# Altium project PCB_Project.PrjPcb
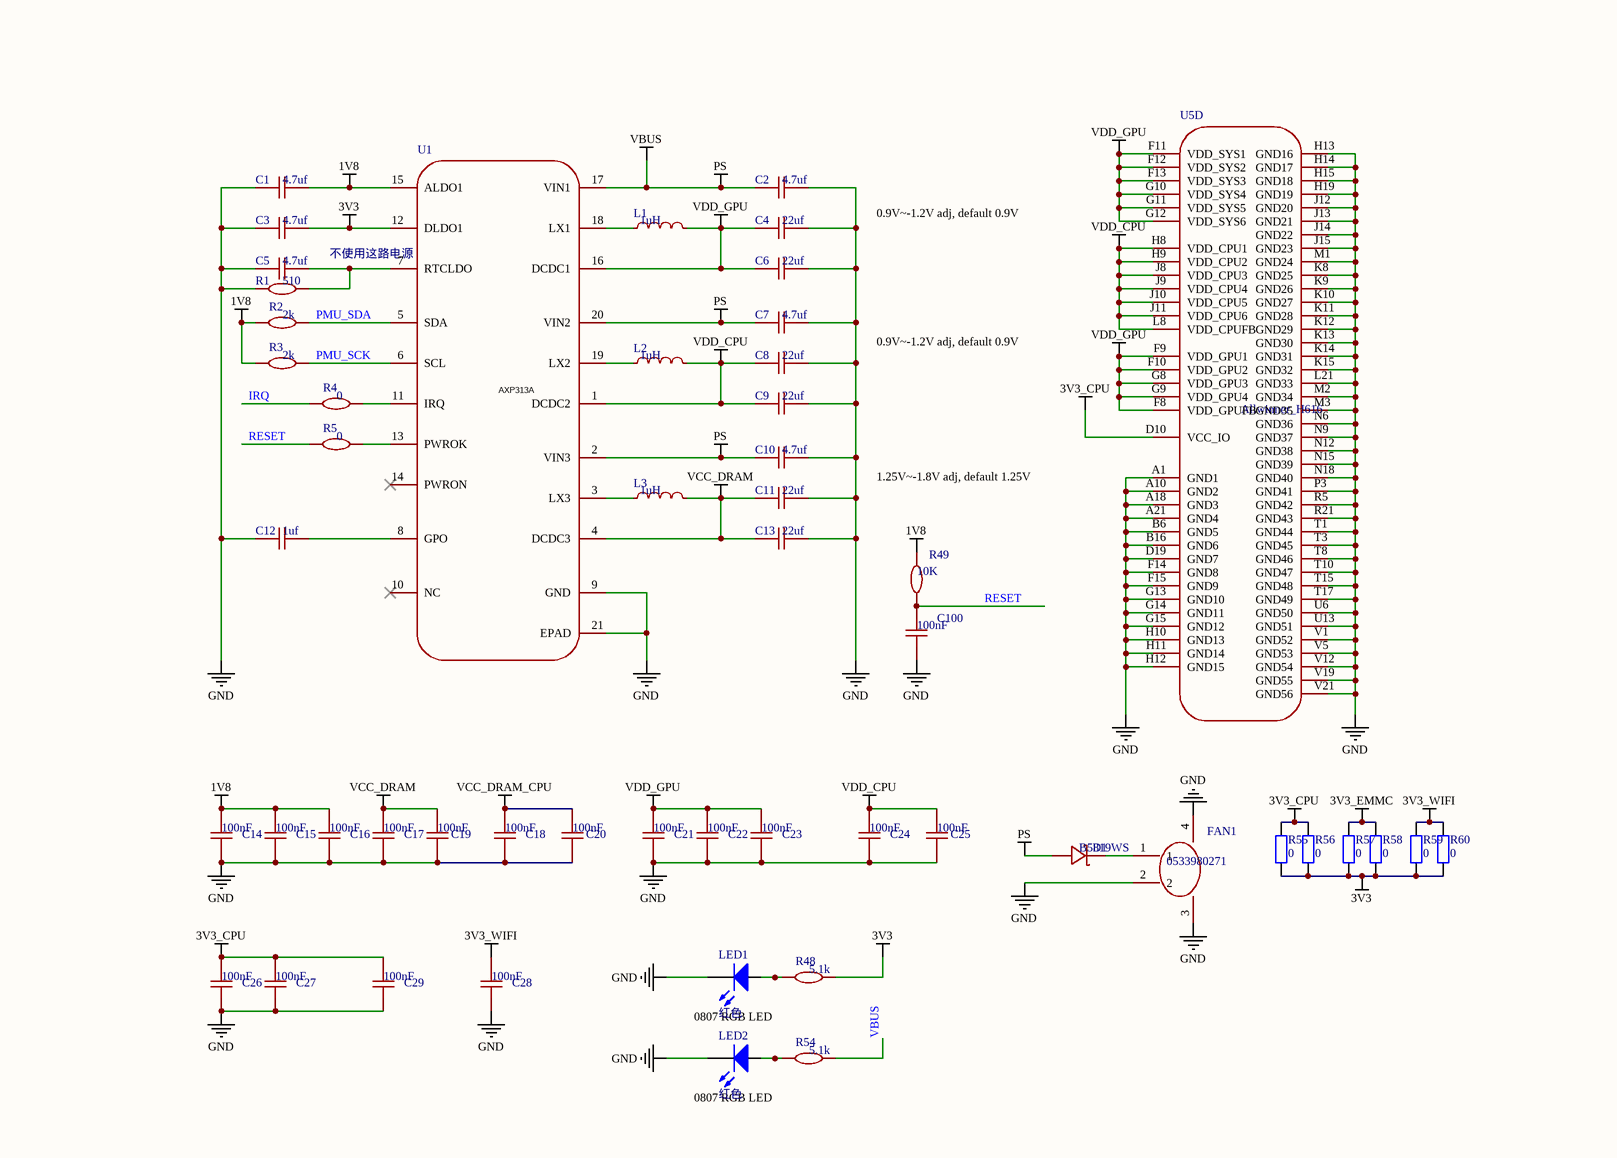
[diagram p0: 1_POWER.schdoc]
4 sheets, 155 parts. Net scope: global (net labels, ports and power ports of the same name join across sheets).
Board file: PCB.pcbdoc
Sheets:
  1_POWER.schdoc
  2_DRAM.schdoc
  3_IO.schdoc
  4_PREP.schdoc

## Sheet 1_POWER.schdoc
size 302 x 215 mm; Symbol: Sheet_A4; Device: Sheet_A4; @Project Name: Yuzuki Chameleon 基于H616的卡片电脑; REV: 1.0; Date: 2021-09-08; Sheet: 1/1; Draw By: GloomyGhost; Company: YuzukiHD; Version: 1.0; @Page No: 1; @Page Count: 4; @Update Date: 2025-03-02; SheetNumber: 1; SheetTotal: 4

### Parts
C1  4.7uf  [C0402]
C2  4.7uf  [C0603]
C3  4.7uf  [C0402]
C4  22uf  [C0603]
C5  4.7uf  [C0402]
C6  22uf  [C0603]
C7  4.7uf  [C0603]
C8  22uf  [C0603]
C9  22uf  [C0603]
C10  4.7uf  [C0603]
C11  22uf  [C0603]
C12  1uf  [C0402]
C13  22uf  [C0603]
C14  100nF  [C0402-NSK]
C15  100nF  [C0402-NSK]
C16  100nF  [C0402-NSK]
C17  100nF  [C0402-NSK]
C18  100nF  [C0402-NSK]
C19  100nF  [C0402-NSK]
C20  100nF  [C0402-NSK]
C21  100nF  [C0402-NSK]
C22  100nF  [C0402-NSK]
C23  100nF  [C0402-NSK]
C24  100nF  [C0402-NSK]
C25  100nF  [C0402-NSK]
C26  100nF  [C0402-NSK]
C27  100nF  [C0402-NSK]
C28  100nF  [C0402-NSK]
C29  100nF  [C0402-NSK]
C100  100nF  [C0402]
D1  B5819WS  [SOD-323_L1.8-W1.3-LS2.5-NSK]
FAN1  0533980271  [CONN-SMD_2P-P1.25_053398-0X71]
L1  1uH  [IND-SMD_L2.0-W1.6_1]
L2  1uH  [IND-SMD_L2.0-W1.6_1]
L3  1uH  [IND-SMD_L2.0-W1.6_1]
LED1  红色  [LED0805_G]
LED2  红色  [LED0805_G]
R1  510  [R0402-NSK_2]
R2  2k  [R0402-NSK_2]
R3  2k  [R0402-NSK_2]
R4  0  [R0402-NSK_2]
R5  0  [R0402-NSK_2]
R48  5.1k  [R0402-NSK_2]
R49  10K  [R0402-NSK_2]
R54  5.1k  [R0402-NSK_2]
R55  0  [R0805_L]
R56  0  [R0805_L]
R57  0  [R0805_L]
R58  0  [R0805_L]
R59  0  [R0805_L]
R60  0  [R0805_L]
U1  AXP313A  [WQFN-20_L3.0-W3.0-P0.40-BL-EP]
U5  Allwinner_H616  [BGA284P65B1200_1400H125]  (part D of 4)

### Nets
1V8: C1.2 C14.2 C15.2 C16.2 R2.1 R3.1 R49.2 U1.15(ALDO1)
3V3: C3.2 R48.2 R55.1 R56.1 R57.1 R58.1 R59.1 R60.1 U1.12(DLDO1)
3V3_CPU: C26.2 C27.2 C29.2 R55.2 R56.2 U5.D10(VCC_IO)
3V3_EMMC: R57.2 R58.2
3V3_WIFI: C28.2 R59.2 R60.2
GND: C1.1 C2.2 C3.1 C4.2 C5.1 C6.2 C7.2 C8.2 C9.2 C10.2 C11.2 C12.1 C13.2 C14.1 C15.1 C16.1 C17.1 C18.1 C19.1 C20.1 C21.1 C22.1 C23.1 C24.1 C25.1 C26.1 C27.1 C28.1 C29.1 C100.1 FAN1.2 FAN1.3 FAN1.4 LED1.2(K) LED2.2(K) R1.1 U1.9(GND) U1.21(EPAD) U5.A1(GND1) U5.A10(GND2) U5.A18(GND3) U5.A21(GND4) U5.B6(GND5) U5.B16(GND6) U5.D19(GND7) U5.F14(GND8) U5.F15(GND9) U5.G13(GND10) U5.G14(GND11) U5.G15(GND12) U5.H10(GND13) U5.H11(GND14) U5.H12(GND15) U5.H13(GND16) U5.H14(GND17) U5.H15(GND18) U5.H19(GND19) U5.J12(GND20) U5.J13(GND21) U5.J14(GND22) U5.J15(GND23) U5.K8(GND25) U5.K9(GND26) U5.K10(GND27) U5.K11(GND28) U5.K12(GND29) U5.K13(GND30) U5.K14(GND31) U5.K15(GND32) U5.L21(GND33) U5.M1(GND24) U5.M2(GND34) U5.M3(GND35) U5.N6(GND36) U5.N9(GND37) U5.N12(GND38) U5.N15(GND39) U5.N18(GND40) U5.P3(GND41) U5.R5(GND42) U5.R21(GND43) U5.T1(GND44) U5.T3(GND45) U5.T8(GND46) U5.T10(GND47) U5.T15(GND48) U5.T17(GND49) U5.U6(GND50) U5.U13(GND51) U5.V1(GND52) U5.V5(GND53) U5.V12(GND54) U5.V19(GND55) U5.V21(GND56)
VBUS: C2.1 C7.1 C10.1 D1.2(A) R54.2 U1.2(VIN3) U1.17(VIN1) U1.20(VIN2)  [also labelled PS]
VCC_DRAM: C11.1 C13.1 C17.2 C19.2 L3.2 U1.4(DCDC3)
VCC_DRAM_CPU: C18.2 C20.2
VDD_CPU: C8.1 C9.1 C24.2 C25.2 L2.2 U1.1(DCDC2) U5.H8(VDD_CPU1) U5.H9(VDD_CPU2) U5.J8(VDD_CPU3) U5.J9(VDD_CPU4) U5.J10(VDD_CPU5) U5.J11(VDD_CPU6) U5.L8(VDD_CPUFB)
VDD_GPU: C4.1 C6.1 C21.2 C22.2 C23.2 L1.2 U1.16(DCDC1) U5.F8(VDD_GPUFB) U5.F9(VDD_GPU1) U5.F10(VDD_GPU2) U5.F11(VDD_SYS1) U5.F12(VDD_SYS2) U5.F13(VDD_SYS3) U5.G8(VDD_GPU3) U5.G9(VDD_GPU4) U5.G10(VDD_SYS4) U5.G11(VDD_SYS5) U5.G12(VDD_SYS6)
IRQ: R4.1
PMU_SCK: R3.2 U1.6(SCL)
PMU_SDA: R2.2 U1.5(SDA)
RESET: C100.2 R5.1 R49.1
NetC5_2: C5.2 R1.2 U1.7(RTCLDO)
NetC12_2: C12.2 U1.8(GPO)
NetD1_1: D1.1(K) FAN1.1
NetL1_1: L1.1 U1.18(LX1)
NetL2_1: L2.1 U1.19(LX2)
NetL3_1: L3.1 U1.3(LX3)
NetLED1_1: LED1.1(A) R48.1
NetLED2_1: LED2.1(A) R54.1
NetR4_2: R4.2 U1.11(IRQ)
NetR5_2: R5.2 U1.13(PWROK)

Not connected (* = marked no-connect by the designer): U1 10(NC)* 14(PWRON)*

### Notes on the sheet
- 0.9V~-1.2V adj, default 0.9V
- 不使用这路电源
- 1.25V~-1.8V adj, default 1.25V
- 0807 RGB LED
- 1
- 2
- 3
- 4
- 5
- A
- B
- C
- D
- TITLE:
- Yuzuki Chameleon 基于H616的卡片电脑
- REV:
- 1.0
- Company:
- Date:
- 2021-09-08
- YuzukiHD
- Drawn By:
- GloomyGhost
- Sheet:
- 1/1

### Library data of the parts
C1 C3 C5 C12 C14-C29 C100 = CAP_0402
C2 C4 C6-C11 C13 = CAP_0603
L1-L3 = CKCS201610-2.2uH/M_2
LED1 LED2 = LED: 贴片LED
R1-R5 R48 R49 R54 = Res_0402
R55-R60 = R: 贴片电阻
U1 = AXP1530

## Sheet 2_DRAM.schdoc
size 302 x 215 mm; Symbol: Sheet_A4; Device: Sheet_A4; @Project Name: YuzukiH616; Company: YuzukiHD; Version: 1.0; @Page No: 2; @Page Count: 4; @Update Date: 2025-03-02; REV: 1.0; Date: 2021-09-08; Sheet: 1/1; Draw By: GloomyGhost; SheetNumber: 2; SheetTotal: 4
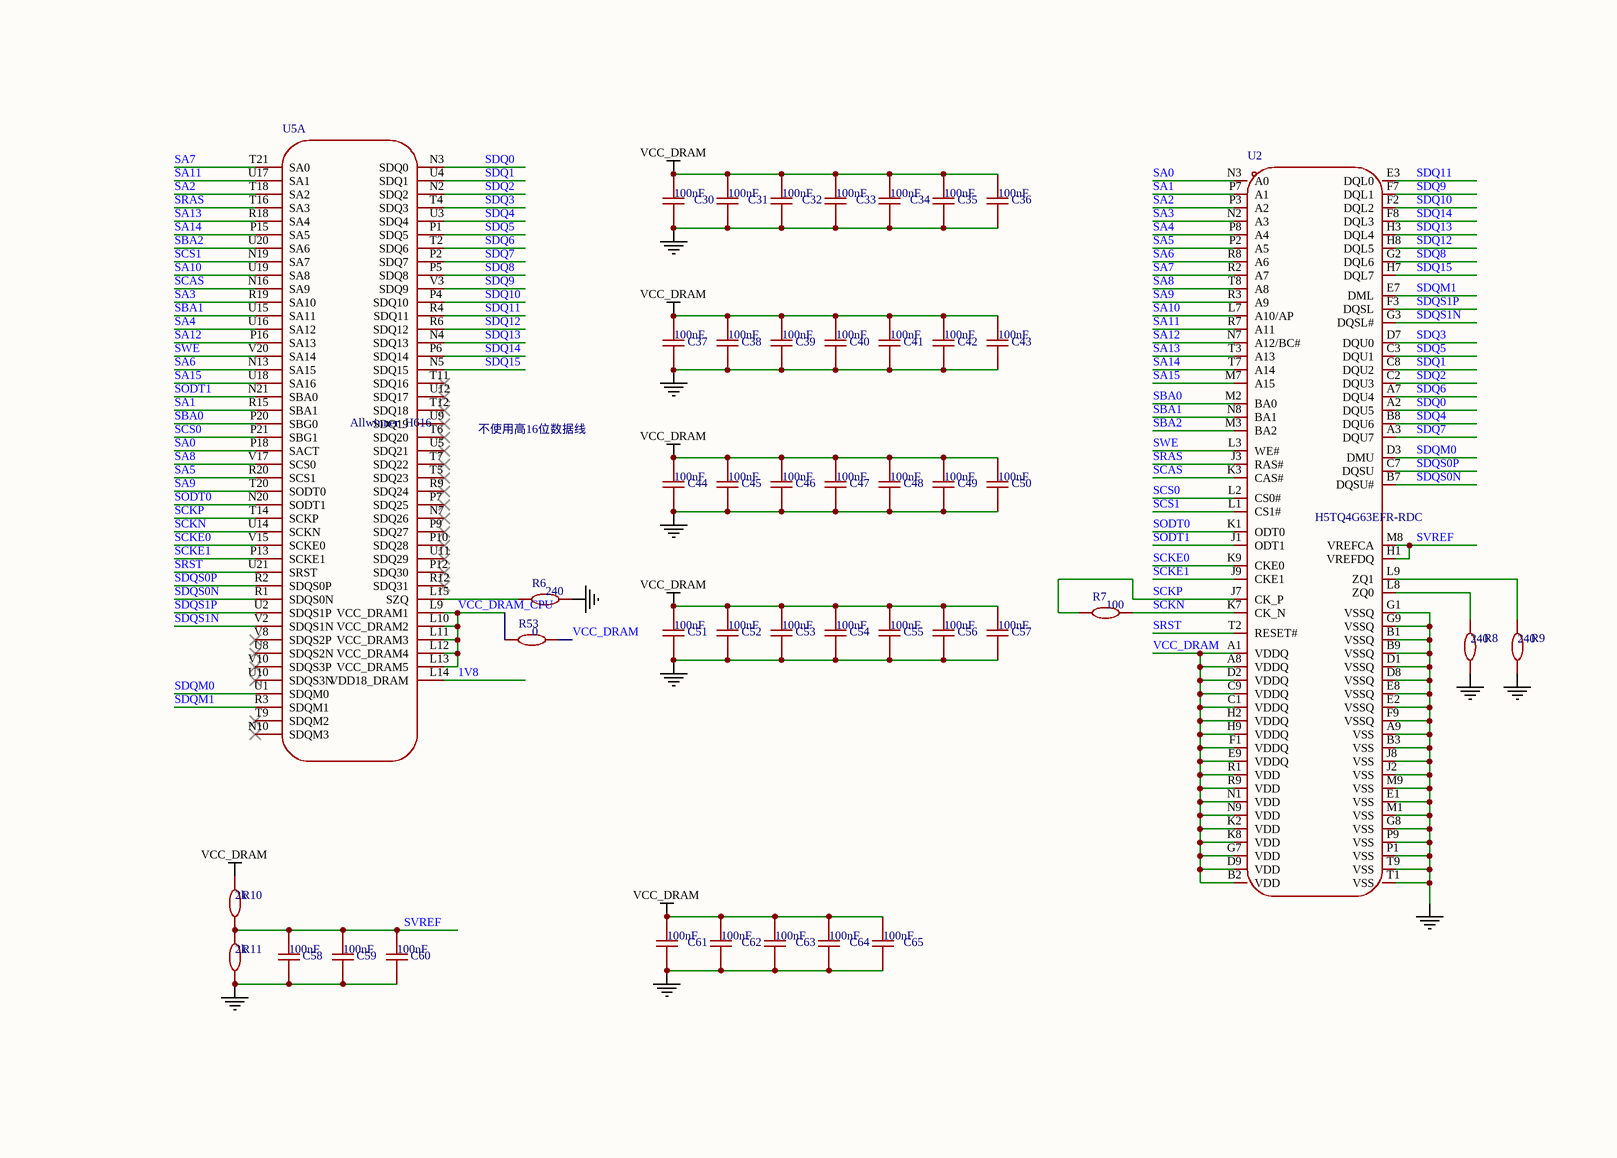
[diagram p1: 2_DRAM.schdoc]

### Parts
C30  100nF  [C0402-NSK]
C31  100nF  [C0402-NSK]
C32  100nF  [C0402-NSK]
C33  100nF  [C0402-NSK]
C34  100nF  [C0402-NSK]
C35  100nF  [C0402-NSK]
C36  100nF  [C0402-NSK]
C37  100nF  [C0402-NSK]
C38  100nF  [C0402-NSK]
C39  100nF  [C0402-NSK]
C40  100nF  [C0402-NSK]
C41  100nF  [C0402-NSK]
C42  100nF  [C0402-NSK]
C43  100nF  [C0402-NSK]
C44  100nF  [C0402-NSK]
C45  100nF  [C0402-NSK]
C46  100nF  [C0402-NSK]
C47  100nF  [C0402-NSK]
C48  100nF  [C0402-NSK]
C49  100nF  [C0402-NSK]
C50  100nF  [C0402-NSK]
C51  100nF  [C0402-NSK]
C52  100nF  [C0402-NSK]
C53  100nF  [C0402-NSK]
C54  100nF  [C0402-NSK]
C55  100nF  [C0402-NSK]
C56  100nF  [C0402-NSK]
C57  100nF  [C0402-NSK]
C58  100nF  [C0402-NSK]
C59  100nF  [C0402-NSK]
C60  100nF  [C0402-NSK]
C61  100nF  [C0402-NSK]
C62  100nF  [C0402-NSK]
C63  100nF  [C0402-NSK]
C64  100nF  [C0402-NSK]
C65  100nF  [C0402-NSK]
R6  240  [R0402-NSK_2]
R7  100  [R0402-NSK_2]
R8  240  [R0402-NSK_2]
R9  240  [R0402-NSK_2]
R10  2k  [R0402-NSK_2]
R11  2k  [R0402-NSK_2]
R53  0  [R0402-NSK_2]
U2  H5TQ4G63EFR-RDC  [FBGA96]
U5  Allwinner_H616  [BGA284P65B1200_1400H125]  (part A of 4)

### Nets
1V8: U5.L14(VDD18_DRAM)
GND: C30.1 C31.1 C32.1 C33.1 C34.1 C35.1 C36.1 C37.1 C38.1 C39.1 C40.1 C41.1 C42.1 C43.1 C44.1 C45.1 C46.1 C47.1 C48.1 C49.1 C50.1 C51.1 C52.1 C53.1 C54.1 C55.1 C56.1 C57.1 C58.1 C59.1 C60.1 C61.1 C62.1 C63.1 C64.1 C65.1 R6.2 R8.1 R9.1 R11.1 U2.A9(VSS) U2.B1(VSSQ) U2.B3(VSS) U2.B9(VSSQ) U2.D1(VSSQ) U2.D8(VSSQ) U2.E1(VSS) U2.E2(VSSQ) U2.E8(VSSQ) U2.F9(VSSQ) U2.G1(VSSQ) U2.G8(VSS) U2.G9(VSSQ) U2.J2(VSS) U2.J8(VSS) U2.M1(VSS) U2.M9(VSS) U2.P1(VSS) U2.P9(VSS) U2.T1(VSS) U2.T9(VSS)
VCC_DRAM: C30.2 C31.2 C32.2 C33.2 C34.2 C35.2 C36.2 C37.2 C38.2 C39.2 C40.2 C41.2 C42.2 C43.2 C44.2 C45.2 C46.2 C47.2 C48.2 C49.2 C50.2 C51.2 C52.2 C53.2 C54.2 C55.2 C56.2 C57.2 C61.2 C62.2 C63.2 C64.2 C65.2 R10.2 R53.2 U2.A1(VDDQ) U2.A8(VDDQ) U2.B2(VDD) U2.C1(VDDQ) U2.C9(VDDQ) U2.D2(VDDQ) U2.D9(VDD) U2.E9(VDDQ) U2.F1(VDDQ) U2.G7(VDD) U2.H2(VDDQ) U2.H9(VDDQ) U2.K2(VDD) U2.K8(VDD) U2.N1(VDD) U2.N9(VDD) U2.R1(VDD) U2.R9(VDD)
VCC_DRAM_CPU: R53.1 U5.L9(VCC_DRAM1) U5.L10(VCC_DRAM2) U5.L11(VCC_DRAM3) U5.L12(VCC_DRAM4) U5.L13(VCC_DRAM5)
SA0: U2.N3(A0) U5.P18(SACT)
SA1: U2.P7(A1) U5.R15(SBA1)
SA2: U2.P3(A2) U5.T18(SA2)
SA3: U2.N2(A3) U5.R19(SA10)
SA4: U2.P8(A4) U5.U16(SA12)
SA5: U2.P2(A5) U5.R20(SCS1)
SA6: U2.R8(A6) U5.N13(SA15)
SA7: U2.R2(A7) U5.T21(SA0)
SA8: U2.T8(A8) U5.V17(SCS0)
SA9: U2.R3(A9) U5.T20(SODT0)
SA10: U2.L7(A10/AP) U5.U19(SA8)
SA11: U2.R7(A11) U5.U17(SA1)
SA12: U2.N7(A12/BC#) U5.P16(SA13)
SA13: U2.T3(A13) U5.R18(SA4)
SA14: U2.T7(A14) U5.P15(SA5)
SA15: U2.M7(A15) U5.U18(SA16)
SBA0: U2.M2(BA0) U5.P20(SBG0)
SBA1: U2.N8(BA1) U5.U15(SA11)
SBA2: U2.M3(BA2) U5.U20(SA6)
SCAS: U2.K3(CAS#) U5.N16(SA9)
SCKE0: U2.K9(CKE0) U5.V15(SCKE0)
SCKE1: U2.J9(CKE1) U5.P13(SCKE1)
SCKN: R7.2 U2.K7(CK_N) U5.U14(SCKN)
SCKP: R7.1 U2.J7(CK_P) U5.T14(SCKP)
SCS0: U2.L2(CS0#) U5.P21(SBG1)
SCS1: U2.L1(CS1#) U5.N19(SA7)
SDQ0: U2.A2(DQU5) U5.N3(SDQ0)
SDQ1: U2.C8(DQU2) U5.U4(SDQ1)
SDQ2: U2.C2(DQU3) U5.N2(SDQ2)
SDQ3: U2.D7(DQU0) U5.T4(SDQ3)
SDQ4: U2.B8(DQU6) U5.U3(SDQ4)
SDQ5: U2.C3(DQU1) U5.P1(SDQ5)
SDQ6: U2.A7(DQU4) U5.T2(SDQ6)
SDQ7: U2.A3(DQU7) U5.P2(SDQ7)
SDQ8: U2.G2(DQL6) U5.P5(SDQ8)
SDQ9: U2.F7(DQL1) U5.V3(SDQ9)
SDQ10: U2.F2(DQL2) U5.P4(SDQ10)
SDQ11: U2.E3(DQL0) U5.R4(SDQ11)
SDQ12: U2.H8(DQL5) U5.R6(SDQ12)
SDQ13: U2.H3(DQL4) U5.N4(SDQ13)
SDQ14: U2.F8(DQL3) U5.P6(SDQ14)
SDQ15: U2.H7(DQL7) U5.N5(SDQ15)
SDQM0: U2.D3(DMU) U5.U1(SDQM0)
SDQM1: U2.E7(DML) U5.R3(SDQM1)
SDQS0N: U2.B7(DQSU#) U5.R1(SDQS0N)
SDQS0P: U2.C7(DQSU) U5.R2(SDQS0P)
SDQS1N: U2.G3(DQSL#) U5.V2(SDQS1N)
SDQS1P: U2.F3(DQSL) U5.U2(SDQS1P)
SODT0: U2.K1(ODT0) U5.N20(SODT1)
SODT1: U2.J1(ODT1) U5.N21(SBA0)
SRAS: U2.J3(RAS#) U5.T16(SA3)
SRST: U2.T2(RESET#) U5.U21(SRST)
SVREF: C58.2 C59.2 C60.2 R10.1 R11.2 U2.H1(VREFDQ) U2.M8(VREFCA)
SWE: U2.L3(WE#) U5.V20(SA14)
NetR6_1: R6.1 U5.L15(SZQ)
NetR8_2: R8.2 U2.L8(ZQ0)
NetR9_2: R9.2 U2.L9(ZQ1)

Not connected (* = marked no-connect by the designer): U5 N7(SDQ26)* N10(SDQM3)* P7(SDQ25)* P9(SDQ27)* P10(SDQ28)* P12(SDQ30)* R9(SDQ24)* R12(SDQ31)* T5(SDQ23)* T6(SDQ20)* T7(SDQ22)* T9(SDQM2)* T11(SDQ16)* T12(SDQ18)* U5(SDQ21)* U8(SDQS2N)* U9(SDQ19)* U10(SDQS3N)* U11(SDQ29)* U12(SDQ17)* V8(SDQS2P)* V10(SDQS3P)*

### Notes on the sheet
- 不使用高16位数据线
- 1
- 2
- 3
- 4
- 5
- A
- B
- C
- D
- TITLE:
- YuzukiH616
- REV:
- 1.0
- Company:
- Date:
- 2025-03-02
- 2021-09-08
- YuzukiHD
- Sheet:
- Drawn By:
- GloomyGhost
- Total:
- 1/1

### Library data of the parts
C30-C65 = CAP_0402
R6-R11 R53 = Res_0402

## Sheet 3_IO.schdoc
size 426 x 302 mm; Symbol: Sheet_A3; Device: Sheet_A3; @Project Name: Yuzuki Chameleon 基于H616的卡片电脑; REV: 1.0; Date: 2022-03-08; Sheet: 1/1; Draw By: GloomyGhost; Company: Your Company; @Update Date: 2025-03-02; @Page Count: 4; @Page No: 3; SheetNumber: 3; SheetTotal: 4
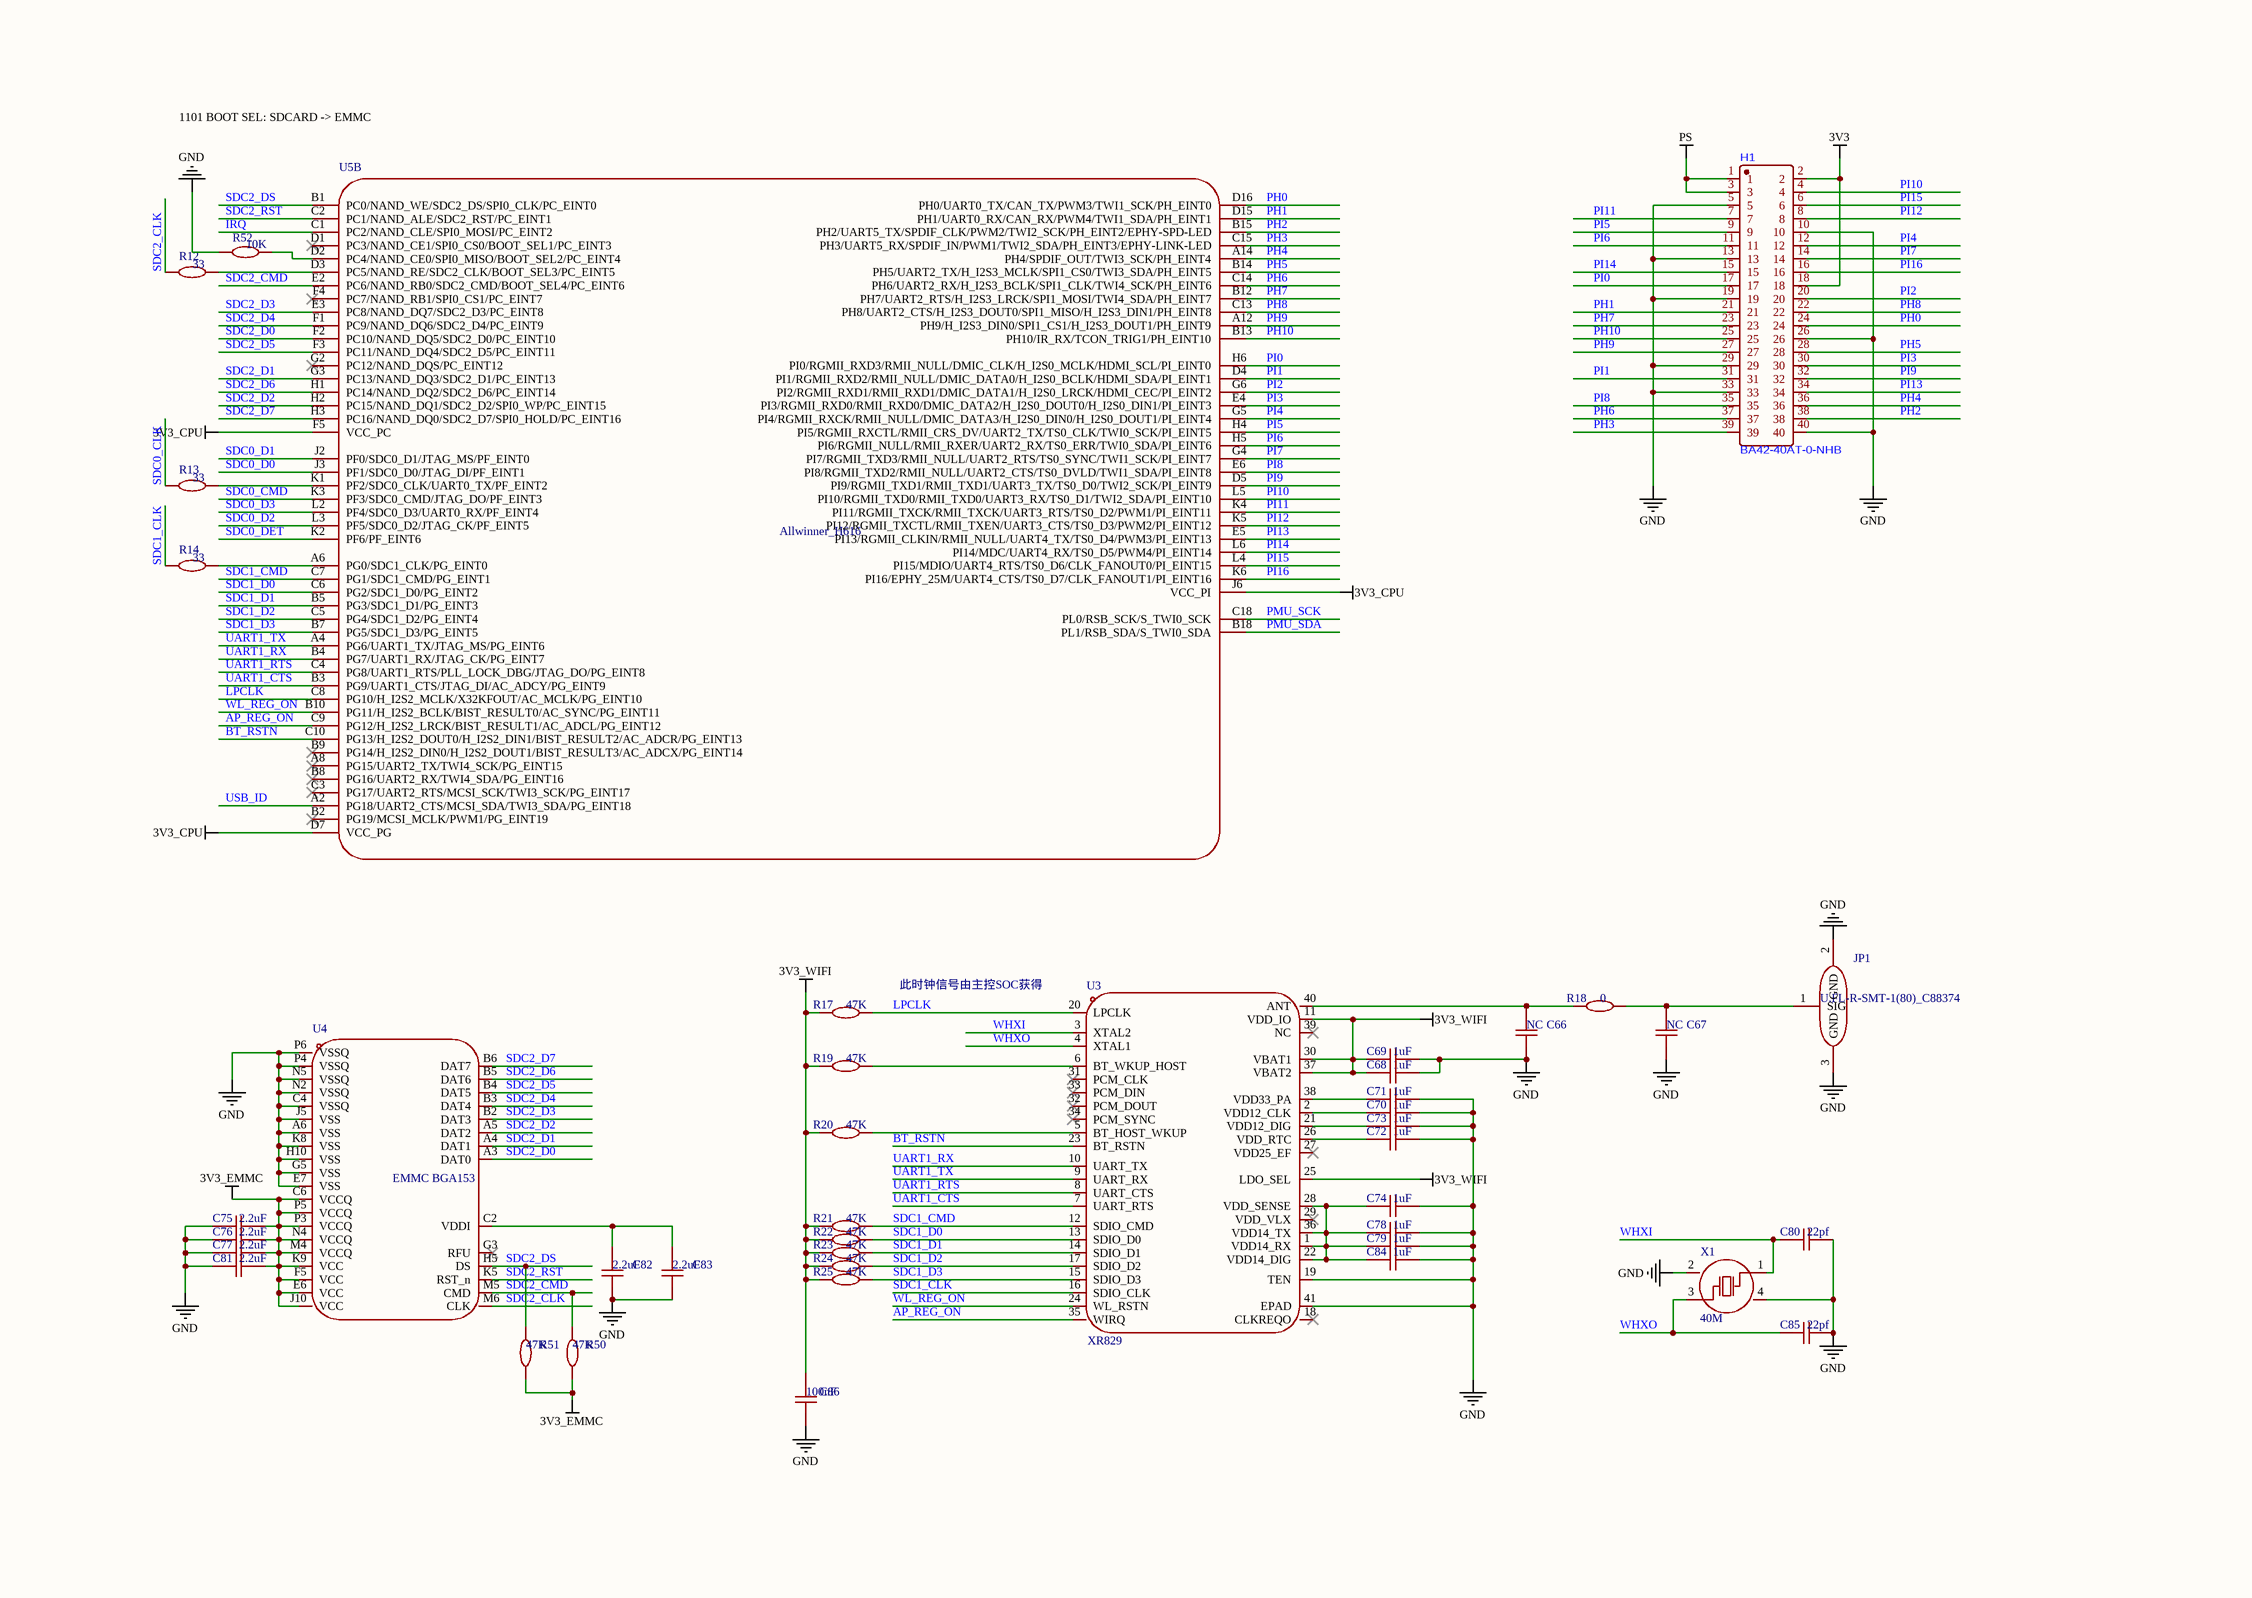
[diagram p2: 3_IO.schdoc]

### Parts
C66  NC  [C0402]
C67  NC  [C0402]
C68  1uF  [C0402]
C69  1uF  [C0402]
C70  1uF  [C0402]
C71  1uF  [C0402]
C72  1uF  [C0402]
C73  1uF  [C0402]
C74  1uF  [C0402]
C75  2.2uF  [C0402]
C76  2.2uF  [C0402]
C77  2.2uF  [C0402]
C78  1uF  [C0402]
C79  1uF  [C0402]
C80  22pf  [C0402]
C81  2.2uF  [C0402]
C82  2.2uF  [C0402]
C83  2.2uF  [C0402]
C84  1uF  [C0402]
C85  22pf  [C0402]
C86  100nF  [c0402-nsk_1]
H1  BA42-40AT-0-NHB  [CONN-SMD_40P-P0.80_10144517-042802LF]
JP1  U.FL-R-SMT-1(80)_C88374  [RF-SMD_FRF05002-JSS103M]
R12  33  [R0402-NSK_2]
R13  33  [R0402-NSK_2]
R14  33  [R0402-NSK_2]
R17  47K  [R0402-NSK_2]
R18  0  [R0402-NSK_2]
R19  47K  [R0402-NSK_2]
R20  47K  [R0402-NSK_2]
R21  47K  [R0402-NSK_2]
R22  47K  [R0402-NSK_2]
R23  47K  [R0402-NSK_2]
R24  47K  [R0402-NSK_2]
R25  47K  [R0402-NSK_2]
R50  47K  [R0402-NSK_2]
R51  47K  [R0402-NSK_2]
R52  10K  [R0402-NSK_2]
U3  XR829  [QFN-40_L5.0-W5.0-P0.40-BL-EP3.4]
U4  EMMC BGA153  [FBGA-153_L13.0-W11.5]
U5  Allwinner_H616  [BGA284P65B1200_1400H125]  (part B of 4)
X1  40M  [OSC-SMD_4P-L2.0-W1.6-BL]

### Nets
3V3: H1.2 H1.18
3V3_CPU: U5.D7(VCC_PG) U5.F5(VCC_PC) U5.J6(VCC_PI)
3V3_EMMC: C75.2 C76.2 C77.2 C81.2 R50.1 R51.1 U4.C6(VCCQ) U4.E6(VCC) U4.F5(VCC) U4.J10(VCC) U4.K9(VCC) U4.M4(VCCQ) U4.N4(VCCQ) U4.P3(VCCQ) U4.P5(VCCQ)
3V3_WIFI: C68.1 C69.1 C86.2 R17.1 R19.1 R20.1 R21.1 R22.1 R23.1 R24.1 R25.1 U3.11(VDD_IO) U3.25(LDO_SEL) U3.30(VBAT1) U3.37(VBAT2)
GND: C66.1 C67.1 C68.2 C69.2 C70.2 C71.2 C72.2 C73.2 C74.2 C75.1 C76.1 C77.1 C78.2 C79.2 C80.2 C81.1 C82.1 C83.1 C84.2 C85.2 C86.1 H1.5 H1.10 H1.13 H1.19 H1.26 H1.29 H1.33 H1.40 JP1.2(GND) JP1.3(GND) R52.2 U3.19(TEN) U3.41(EPAD) U4.A6(VSS) U4.C4(VSSQ) U4.E7(VSS) U4.G5(VSS) U4.H10(VSS) U4.J5(VSS) U4.K8(VSS) U4.N2(VSSQ) U4.N5(VSSQ) U4.P4(VSSQ) U4.P6(VSSQ) X1.2(GND) X1.4(GND)
PS: H1.1 H1.3  [project net VBUS]
AP_REG_ON: U3.35(WIRQ) U5.C9(PG12/H_I2S2_LRCK/BIST_RESULT1/AC_ADCL/PG_EINT12)
BT_RSTN: U3.23(BT_RSTN) U5.C10(PG13/H_I2S2_DOUT0/H_I2S2_DIN1/BIST_RESULT2/AC_ADCR/PG_EINT13)
IRQ: U5.C1(PC2/NAND_CLE/SPI0_MOSI/PC_EINT2)
LPCLK: R17.2 U3.20(LPCLK) U5.C8(PG10/H_I2S2_MCLK/X32KFOUT/AC_MCLK/PG_EINT10)
PH0: H1.24 U5.D16(PH0/UART0_TX/CAN_TX/PWM3/TWI1_SCK/PH_EINT0)
PH1: H1.21 U5.D15(PH1/UART0_RX/CAN_RX/PWM4/TWI1_SDA/PH_EINT1)
PH2: H1.38 U5.B15(PH2/UART5_TX/SPDIF_CLK/PWM2/TWI2_SCK/PH_EINT2/EPHY-SPD-LED)
PH3: H1.39 U5.C15(PH3/UART5_RX/SPDIF_IN/PWM1/TWI2_SDA/PH_EINT3/EPHY-LINK-LED)
PH4: H1.36 U5.A14(PH4/SPDIF_OUT/TWI3_SCK/PH_EINT4)
PH5: H1.28 U5.B14(PH5/UART2_TX/H_I2S3_MCLK/SPI1_CS0/TWI3_SDA/PH_EINT5)
PH6: H1.37 U5.C14(PH6/UART2_RX/H_I2S3_BCLK/SPI1_CLK/TWI4_SCK/PH_EINT6)
PH7: H1.23 U5.B12(PH7/UART2_RTS/H_I2S3_LRCK/SPI1_MOSI/TWI4_SDA/PH_EINT7)
PH8: H1.22 U5.C13(PH8/UART2_CTS/H_I2S3_DOUT0/SPI1_MISO/H_I2S3_DIN1/PH_EINT8)
PH9: H1.27 U5.A12(PH9/H_I2S3_DIN0/SPI1_CS1/H_I2S3_DOUT1/PH_EINT9)
PH10: H1.25 U5.B13(PH10/IR_RX/TCON_TRIG1/PH_EINT10)
PI0: H1.17 U5.H6(PI0/RGMII_RXD3/RMII_NULL/DMIC_CLK/H_I2S0_MCLK/HDMI_SCL/PI_EINT0)
PI1: H1.31 U5.D4(PI1/RGMII_RXD2/RMII_NULL/DMIC_DATA0/H_I2S0_BCLK/HDMI_SDA/PI_EINT1)
PI2: H1.20 U5.G6(PI2/RGMII_RXD1/RMII_RXD1/DMIC_DATA1/H_I2S0_LRCK/HDMI_CEC/PI_EINT2)
PI3: H1.30 U5.E4(PI3/RGMII_RXD0/RMII_RXD0/DMIC_DATA2/H_I2S0_DOUT0/H_I2S0_DIN1/PI_EINT3)
PI4: H1.12 U5.G5(PI4/RGMII_RXCK/RMII_NULL/DMIC_DATA3/H_I2S0_DIN0/H_I2S0_DOUT1/PI_EINT4)
PI5: H1.9 U5.H4(PI5/RGMII_RXCTL/RMII_CRS_DV/UART2_TX/TS0_CLK/TWI0_SCK/PI_EINT5)
PI6: H1.11 U5.H5(PI6/RGMII_NULL/RMII_RXER/UART2_RX/TS0_ERR/TWI0_SDA/PI_EINT6)
PI7: H1.14 U5.G4(PI7/RGMII_TXD3/RMII_NULL/UART2_RTS/TS0_SYNC/TWI1_SCK/PI_EINT7)
PI8: H1.35 U5.E6(PI8/RGMII_TXD2/RMII_NULL/UART2_CTS/TS0_DVLD/TWI1_SDA/PI_EINT8)
PI9: H1.32 U5.D5(PI9/RGMII_TXD1/RMII_TXD1/UART3_TX/TS0_D0/TWI2_SCK/PI_EINT9)
PI10: H1.4 U5.L5(PI10/RGMII_TXD0/RMII_TXD0/UART3_RX/TS0_D1/TWI2_SDA/PI_EINT10)
PI11: H1.7 U5.K4(PI11/RGMII_TXCK/RMII_TXCK/UART3_RTS/TS0_D2/PWM1/PI_EINT11)
PI12: H1.8 U5.K5(PI12/RGMII_TXCTL/RMII_TXEN/UART3_CTS/TS0_D3/PWM2/PI_EINT12)
PI13: H1.34 U5.E5(PI13/RGMII_CLKIN/RMII_NULL/UART4_TX/TS0_D4/PWM3/PI_EINT13)
PI14: H1.15 U5.L6(PI14/MDC/UART4_RX/TS0_D5/PWM4/PI_EINT14)
PI15: H1.6 U5.L4(PI15/MDIO/UART4_RTS/TS0_D6/CLK_FANOUT0/PI_EINT15)
PI16: H1.16 U5.K6(PI16/EPHY_25M/UART4_CTS/TS0_D7/CLK_FANOUT1/PI_EINT16)
PMU_SCK: U5.C18(PL0/RSB_SCK/S_TWI0_SCK)
PMU_SDA: U5.B18(PL1/RSB_SDA/S_TWI0_SDA)
SDC0_CLK: R13.1
SDC0_CMD: U5.K3(PF3/SDC0_CMD/JTAG_DO/PF_EINT3)
SDC0_D0: U5.J3(PF1/SDC0_D0/JTAG_DI/PF_EINT1)
SDC0_D1: U5.J2(PF0/SDC0_D1/JTAG_MS/PF_EINT0)
SDC0_D2: U5.L3(PF5/SDC0_D2/JTAG_CK/PF_EINT5)
SDC0_D3: U5.L2(PF4/SDC0_D3/UART0_RX/PF_EINT4)
SDC0_DET: U5.K2(PF6/PF_EINT6)
SDC1_CLK: R14.1 U3.16(SDIO_CLK)
SDC1_CMD: R21.2 U3.12(SDIO_CMD) U5.C7(PG1/SDC1_CMD/PG_EINT1)
SDC1_D0: R22.2 U3.13(SDIO_D0) U5.C6(PG2/SDC1_D0/PG_EINT2)
SDC1_D1: R23.2 U3.14(SDIO_D1) U5.B5(PG3/SDC1_D1/PG_EINT3)
SDC1_D2: R24.2 U3.17(SDIO_D2) U5.C5(PG4/SDC1_D2/PG_EINT4)
SDC1_D3: R25.2 U3.15(SDIO_D3) U5.B7(PG5/SDC1_D3/PG_EINT5)
SDC2_CLK: R12.1 U4.M6(CLK)
SDC2_CMD: R50.2 U4.M5(CMD) U5.E2(PC6/NAND_RB0/SDC2_CMD/BOOT_SEL4/PC_EINT6)
SDC2_D0: U4.A3(DAT0) U5.F2(PC10/NAND_DQ5/SDC2_D0/PC_EINT10)
SDC2_D1: U4.A4(DAT1) U5.G3(PC13/NAND_DQ3/SDC2_D1/PC_EINT13)
SDC2_D2: U4.A5(DAT2) U5.H2(PC15/NAND_DQ1/SDC2_D2/SPI0_WP/PC_EINT15)
SDC2_D3: U4.B2(DAT3) U5.E3(PC8/NAND_DQ7/SDC2_D3/PC_EINT8)
SDC2_D4: U4.B3(DAT4) U5.F1(PC9/NAND_DQ6/SDC2_D4/PC_EINT9)
SDC2_D5: U4.B4(DAT5) U5.F3(PC11/NAND_DQ4/SDC2_D5/PC_EINT11)
SDC2_D6: U4.B5(DAT6) U5.H1(PC14/NAND_DQ2/SDC2_D6/PC_EINT14)
SDC2_D7: U4.B6(DAT7) U5.H3(PC16/NAND_DQ0/SDC2_D7/SPI0_HOLD/PC_EINT16)
SDC2_DS: R51.2 U4.H5(DS) U5.B1(PC0/NAND_WE/SDC2_DS/SPI0_CLK/PC_EINT0)
SDC2_RST: U4.K5(RST_n) U5.C2(PC1/NAND_ALE/SDC2_RST/PC_EINT1)
UART1_CTS: U3.7(UART_RTS) U5.B3(PG9/UART1_CTS/JTAG_DI/AC_ADCY/PG_EINT9)
UART1_RTS: U3.8(UART_CTS) U5.C4(PG8/UART1_RTS/PLL_LOCK_DBG/JTAG_DO/PG_EINT8)
UART1_RX: U3.10(UART_TX) U5.B4(PG7/UART1_RX/JTAG_CK/PG_EINT7)
UART1_TX: U3.9(UART_RX) U5.A4(PG6/UART1_TX/JTAG_MS/PG_EINT6)
USB_ID: U5.A2(PG18/UART2_CTS/MCSI_SDA/TWI3_SDA/PG_EINT18)
WHXI: C80.1 U3.3(XTAL2) X1.1(OSC1)
WHXO: C85.1 U3.4(XTAL1) X1.3(OSC2)
WL_REG_ON: U3.24(WL_RSTN) U5.B10(PG11/H_I2S2_BCLK/BIST_RESULT0/AC_SYNC/PG_EINT11)
NetC66_2: C66.2 R18.1 U3.40(ANT)
NetC67_2: C67.2 JP1.1(SIG) R18.2
NetC70_1: C70.1 U3.2(VDD12_CLK)
NetC71_1: C71.1 U3.38(VDD33_PA)
NetC72_1: C72.1 U3.26(VDD_RTC)
NetC73_1: C73.1 U3.21(VDD12_DIG)
NetC74_1: C74.1 C78.1 C79.1 C84.1 U3.1(VDD14_RX) U3.22(VDD14_DIG) U3.28(VDD_SENSE) U3.36(VDD14_TX)
NetC82_2: C82.2 C83.2 U4.C2(VDDI)
NetR12_2: R12.2 U5.D3(PC5/NAND_RE/SDC2_CLK/BOOT_SEL3/PC_EINT5)
NetR13_2: R13.2 U5.K1(PF2/SDC0_CLK/UART0_TX/PF_EINT2)
NetR14_2: R14.2 U5.A6(PG0/SDC1_CLK/PG_EINT0)
NetR19_2: R19.2 U3.6(BT_WKUP_HOST)
NetR20_2: R20.2 U3.5(BT_HOST_WKUP)
NetR52_1: R52.1 U5.D2(PC4/NAND_CE0/SPI0_MISO/BOOT_SEL2/PC_EINT4)

Not connected (* = marked no-connect by the designer): U3 18(CLKREQO)* 27(VDD25_EF)* 29(VDD_VLX)* 31(PCM_CLK)* 32(PCM_DOUT)* 33(PCM_DIN)* 34(PCM_SYNC)* 39(NC)*; U4 G3(RFU)*; U5 A8(PG15/UART2_TX/TWI4_SCK/PG_EINT15)* B2(PG19/MCSI_MCLK/PWM1/PG_EINT19)* B8(PG16/UART2_RX/TWI4_SDA/PG_EINT16)* B9(PG14/H_I2S2_DIN0/H_I2S2_DOUT1/BIST_RESULT3/AC_ADCX/PG_EINT14)* C3(PG17/UART2_RTS/MCSI_SCK/TWI3_SCK/PG_EINT17)* D1(PC3/NAND_CE1/SPI0_CS0/BOOT_SEL1/PC_EINT3)* F4(PC7/NAND_RB1/SPI0_CS1/PC_EINT7)* G2(PC12/NAND_DQS/PC_EINT12)*

### Notes on the sheet
- 1101 BOOT SEL: SDCARD -> EMMC
- (near R17) 此时钟信号由主控SOC获得
- 1
- 2
- 3
- 4
- 5
- 6
- 7
- 8
- A
- B
- C
- D
- E
- TITLE:
- Yuzuki Chameleon 基于H616的卡片电脑
- REV:
- 1.0
- Date:
- Company:
- 2022-03-08
- Your Company
- Drawn By:
- GloomyGhost
- Sheet:
- 1/1

### Library data of the parts
C66-C85 = CAP_0402
C86 = FN15X104K250PNG
R12-R14 R17-R25 R50-R52 = Res_0402
X1 = SX32Y024000BC1T

## Sheet 4_PREP.schdoc
size 302 x 215 mm; Symbol: Sheet_A4; Device: Sheet_A4; @Project Name: Yuzuki Chameleon 基于H616的开发板; Company: YuzukiHD; Version: 1.0; @Page No: 4; @Page Count: 4; @Update Date: 2025-03-02; REV: 1.0; Date: 2021-09-08; Sheet: 1/1; Draw By: GloomyGhost; SheetNumber: 4; SheetTotal: 4
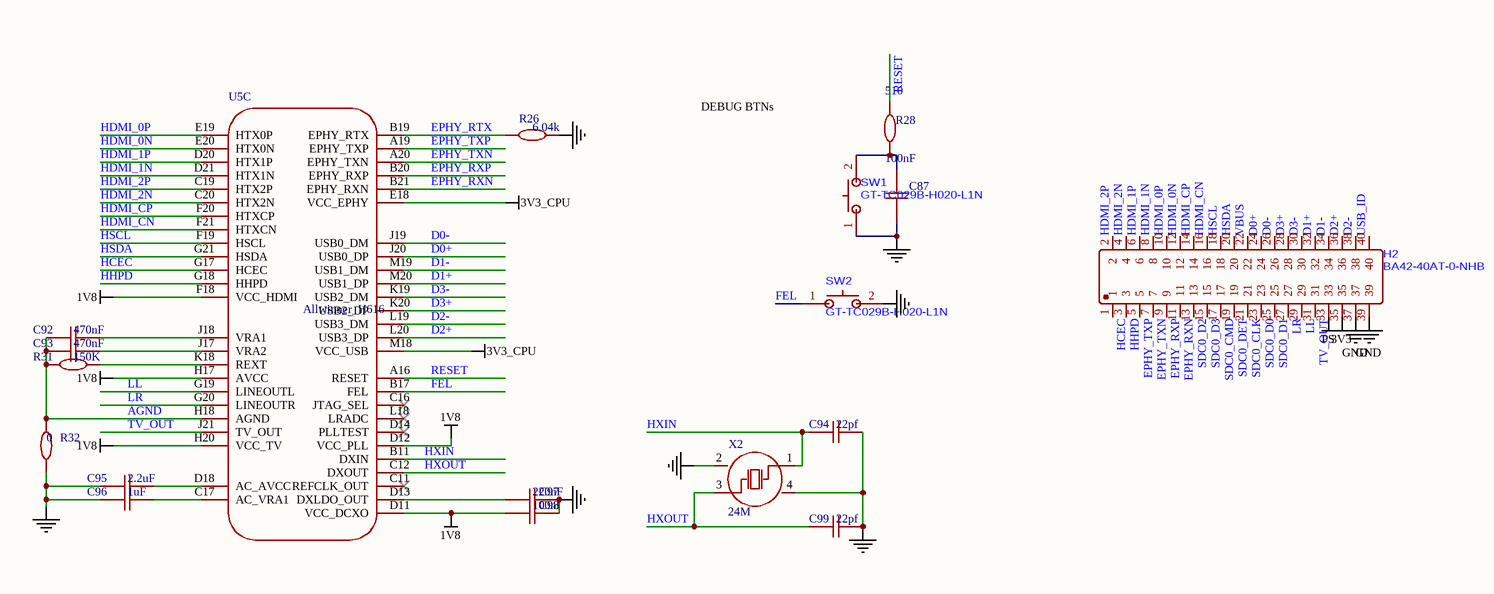
[diagram p3: 4_PREP.schdoc]

### Parts
C87  100nF  [C0402-NSK]
C92  470nF  [C0402]
C93  470nF  [C0402]
C94  22pf  [C0402]
C95  2.2uF  [C0402]
C96  1uF  [C0402]
C97  220nF  [C0402]
C98  100nf  [C0402]
C99  22pf  [C0402]
H2  BA42-40AT-0-NHB  [CONN-SMD_40P-P0.80_10144517-042802LF]
R26  6.04k  [R0402-NSK_2]
R28  510  [R0402-NSK_2]
R31  150K  [R0402-NSK_2]
R32  0  [R0402-NSK_2]
SW1  GT-TC029B-H020-L1N  [SW-SMD_L3.9-W2.9-P4.15-LS5.0]
SW2  GT-TC029B-H020-L1N  [SW-SMD_L3.9-W2.9-P4.15-LS5.0]
U5  Allwinner_H616  [BGA284P65B1200_1400H125]  (part C of 4)
X2  24M  [OSC-SMD_4P-L2.0-W1.6-BL]

### Nets
1V8: C98.1 U5.D11(VCC_DCXO) U5.D12(VCC_PLL) U5.F18(VCC_HDMI) U5.H17(AVCC) U5.H20(VCC_TV)
3V3: H2.35
3V3_CPU: U5.E18(VCC_EPHY) U5.M18(VCC_USB)
GND: C87.1 C94.2 C95.1 C96.1 C97.2 C98.2 C99.2 H2.37 H2.39 R26.2 R32.1 SW1.1 SW2.2 X2.2(GND) X2.4(GND)
VBUS: H2.22 H2.33  [also labelled PS]
AGND: C92.1 C93.1 R31.1 R32.2 U5.H18(AGND)
D0+: H2.24 U5.J20(USB0_DP)
D0-: H2.26 U5.J19(USB0_DM)
D1+: H2.32 U5.M20(USB1_DP)
D1-: H2.34 U5.M19(USB1_DM)
D2+: H2.36 U5.L20(USB3_DP)
D2-: H2.38 U5.L19(USB3_DM)
D3+: H2.28 U5.K20(USB2_DP)
D3-: H2.30 U5.K19(USB2_DM)
EPHY_RTX: R26.1 U5.B19(EPHY_RTX)
EPHY_RXN: H2.11 U5.B21(EPHY_RXN)
EPHY_RXP: H2.9 U5.B20(EPHY_RXP)
EPHY_TXN: H2.7 U5.A20(EPHY_TXN)
EPHY_TXP: H2.5 U5.A19(EPHY_TXP)
FEL: SW2.1 U5.B17(FEL)
HCEC: H2.1 U5.G17(HCEC)
HDMI_0N: H2.12 U5.E20(HTX0N)
HDMI_0P: H2.10 U5.E19(HTX0P)
HDMI_1N: H2.8 U5.D21(HTX1N)
HDMI_1P: H2.6 U5.D20(HTX1P)
HDMI_2N: H2.4 U5.C20(HTX2N)
HDMI_2P: H2.2 U5.C19(HTX2P)
HDMI_CN: H2.16 U5.F21(HTXCN)
HDMI_CP: H2.14 U5.F20(HTXCP)
HHPD: H2.3 U5.G18(HHPD)
HSCL: H2.18 U5.F19(HSCL)
HSDA: H2.20 U5.G21(HSDA)
HXIN: C94.1 U5.B11(DXIN) X2.1(OSC1)
HXOUT: C99.1 U5.C12(DXOUT) X2.3(OSC2)
LL: H2.29 U5.G19(LINEOUTL)
LR: H2.27 U5.G20(LINEOUTR)
RESET: R28.1 U5.A16(RESET)
SDC0_CLK: H2.21
SDC0_CMD: H2.17
SDC0_D0: H2.23
SDC0_D1: H2.25
SDC0_D2: H2.13
SDC0_D3: H2.15
SDC0_DET: H2.19
TV_OUT: H2.31 U5.J21(TV_OUT)
USB_ID: H2.40
NetC87_2: C87.2 R28.2 SW1.2
NetC92_2: C92.2 U5.J18(VRA1)
NetC93_2: C93.2 U5.J17(VRA2)
NetC95_2: C95.2 U5.D18(AC_AVCC)
NetC96_2: C96.2 U5.C17(AC_VRA1)
NetC97_1: C97.1 U5.D13(DXLDO_OUT)
NetR31_2: R31.2 U5.K18(REXT)

Not connected (* = marked no-connect by the designer): U5 C11(REFCLK_OUT)* C16(JTAG_SEL)* D14(PLLTEST)* L18(LRADC)*

### Notes on the sheet
- DEBUG BTNs
- 1
- 2
- 3
- 4
- 5
- A
- B
- C
- D
- TITLE:
- Yuzuki Chameleon 基于H616的开发板
- REV:
- 1.0
- Company:
- Date:
- 2025-03-02
- 2021-09-08
- YuzukiHD
- Sheet:
- Drawn By:
- GloomyGhost
- Total:
- 1/1

### Library data of the parts
C87 = FN15X104K250PNG
C92-C99 = CAP_0402
R26 R31 R32 = Res_0402
R28 = TR0402D10K0Q1025Z
X2 = SX32Y024000BC1T

## Nets that join several sheets
1V8: 1_POWER (8 pins), 2_DRAM (U5.L14), 4_PREP (6 pins)
3V3: 1_POWER (9 pins), 3_IO (H1.2 H1.18), 4_PREP (H2.35)
3V3_CPU: 1_POWER (6 pins), 3_IO (U5.D7 U5.F5 U5.J6), 4_PREP (U5.E18 U5.M18)
3V3_EMMC: 1_POWER (R57.2 R58.2), 3_IO (15 pins)
3V3_WIFI: 1_POWER (C28.2 R59.2 R60.2), 3_IO (15 pins)
GND: 1_POWER (94 pins), 2_DRAM (61 pins), 3_IO (47 pins), 4_PREP (15 pins)
VBUS: 1_POWER (8 pins), 3_IO (H1.1 H1.3), 4_PREP (H2.22 H2.33)
VCC_DRAM: 1_POWER (6 pins), 2_DRAM (53 pins)
VCC_DRAM_CPU: 1_POWER (C18.2 C20.2), 2_DRAM (6 pins)
IRQ: 1_POWER (R4.1), 3_IO (U5.C1)
PMU_SCK: 1_POWER (R3.2 U1.6), 3_IO (U5.C18)
PMU_SDA: 1_POWER (R2.2 U1.5), 3_IO (U5.B18)
RESET: 1_POWER (C100.2 R5.1 R49.1), 4_PREP (R28.1 U5.A16)
SDC0_CLK: 3_IO (R13.1), 4_PREP (H2.21)
SDC0_CMD: 3_IO (U5.K3), 4_PREP (H2.17)
SDC0_D0: 3_IO (U5.J3), 4_PREP (H2.23)
SDC0_D1: 3_IO (U5.J2), 4_PREP (H2.25)
SDC0_D2: 3_IO (U5.L3), 4_PREP (H2.13)
SDC0_D3: 3_IO (U5.L2), 4_PREP (H2.15)
SDC0_DET: 3_IO (U5.K2), 4_PREP (H2.19)
USB_ID: 3_IO (U5.A2), 4_PREP (H2.40)